# EAGLE design untitled (EAGLE 7.7.0)
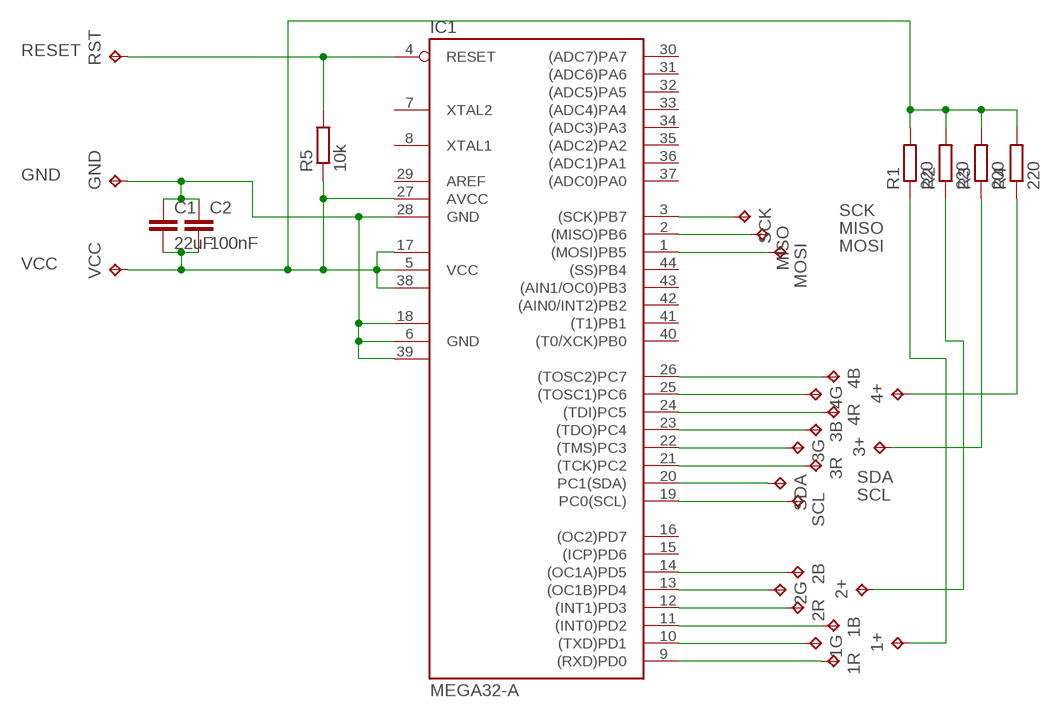
[diagram p0: schematic, sheet 1]

## Parts
1+  TPTP19SQ  [TP19SQ]
1B  TPTP19SQ  [TP19SQ]
1G  TPTP19SQ  [TP19SQ]
1R  TPTP19SQ  [TP19SQ]
2+  TPTP19SQ  [TP19SQ]
2B  TPTP19SQ  [TP19SQ]
2G  TPTP19SQ  [TP19SQ]
2R  TPTP19SQ  [TP19SQ]
3+  TPTP19SQ  [TP19SQ]
3B  TPTP19SQ  [TP19SQ]
3G  TPTP19SQ  [TP19SQ]
3R  TPTP19SQ  [TP19SQ]
4+  TPTP19SQ  [TP19SQ]
4B  TPTP19SQ  [TP19SQ]
4G  TPTP19SQ  [TP19SQ]
4R  TPTP19SQ  [TP19SQ]
C1  22uF  C-EU025-024X044  [C025-024X044]
C2  100nF  C-EU025-024X044  [C025-024X044]
GND  TPTP19SQ  [TP19SQ]
IC1  MEGA32-A  [TQFP44]
MISO  TPTP19SQ  [TP19SQ]
MOSI  TPTP19SQ  [TP19SQ]
R1  220  R-EU_M0805  [M0805]
R2  220  R-EU_M0805  [M0805]
R3  200  R-EU_M0805  [M0805]
R4  220  R-EU_M0805  [M0805]
R5  10k  R-EU_M0805  [M0805]
RST  TPTP19SQ  [TP19SQ]
SCK  SCK  TPTP19SQ  [TP19SQ]
SCL  TPTP19SQ  [TP19SQ]
SDA  TPTP19SQ  [TP19SQ]
VCC  TPTP19SQ  [TP19SQ]

## Nets
GND: C1.1 C2.1 GND.TP IC1.6(GND) IC1.18(GND1) IC1.28(GND) IC1.39(GND2)
MISO: IC1.2((MISO)PB6) MISO.TP
MOSI: IC1.1((MOSI)PB5) MOSI.TP
N$1: 1R.TP IC1.9((RXD)PD0)
N$2: 1G.TP IC1.10((TXD)PD1)
N$3: 1B.TP IC1.11((INT0)PD2)
N$4: 2R.TP IC1.12((INT1)PD3)
N$5: 2G.TP IC1.13((OC1B)PD4)
N$6: 2B.TP IC1.14((OC1A)PD5)
N$7: 3R.TP IC1.21((TCK)PC2)
N$8: 3G.TP IC1.22((TMS)PC3)
N$9: 3B.TP IC1.23((TDO)PC4)
N$10: 4R.TP IC1.24((TDI)PC5)
N$11: 4G.TP IC1.25((TOSC1)PC6)
N$12: 4B.TP IC1.26((TOSC2)PC7)
N$13: 1+.TP R1.1
N$14: 2+.TP R2.1
N$15: 3+.TP R3.1
N$16: 4+.TP R4.1
RESET: IC1.4(RESET) R5.2 RST.TP
SCK: IC1.3((SCK)PB7) SCK.TP
SCL: IC1.19(PC0(SCL)) SCL.TP
SDA: IC1.20(PC1(SDA)) SDA.TP
VCC: C1.2 C2.2 IC1.5(VCC) IC1.17(VCC1) IC1.27(AVCC) IC1.38(VCC2) R1.2 R2.2 R3.2 R4.2 R5.1 VCC.TP
Unconnected: IC1.7(XTAL2) IC1.8(XTAL1) IC1.15((ICP)PD6) IC1.16((OC2)PD7) IC1.29(AREF) IC1.30((ADC7)PA7) IC1.31((ADC6)PA6) IC1.32((ADC5)PA5) IC1.33((ADC4)PA4) IC1.34((ADC3)PA3) IC1.35((ADC2)PA2) IC1.36((ADC1)PA1) IC1.37((ADC0)PA0) IC1.40((T0/XCK)PB0) IC1.41((T1)PB1) IC1.42((AIN0/INT2)PB2) IC1.43((AIN1/OC0)PB3) IC1.44((SS)PB4)

## Library data of the parts
1+ 1B 1G 1R 2+ 2B 2G 2R 3+ 3B 3G 3R 4+ 4B 4G 4R GND MISO MOSI RST SCK SCL SDA VCC = testpad:TP: Test pad
C1 C2 = resistor:C-EU: CAPACITOR, European symbol
IC1 = atmel:MEGA32: MICROCONTROLLER 32 Kbytes FLASH 2 Kbytes SRAM 1 Kbytes EEPROM USART 8-channel 10 bit ADC Source: www.atmel.com .. doc2503.pdf; MPN: ATMEGA32-16AU; OC_FARNELL: 9171274; OC_NEWARK: 69K6677
R1-R5 = rcl:R-EU_: RESISTOR, European symbol

## Board
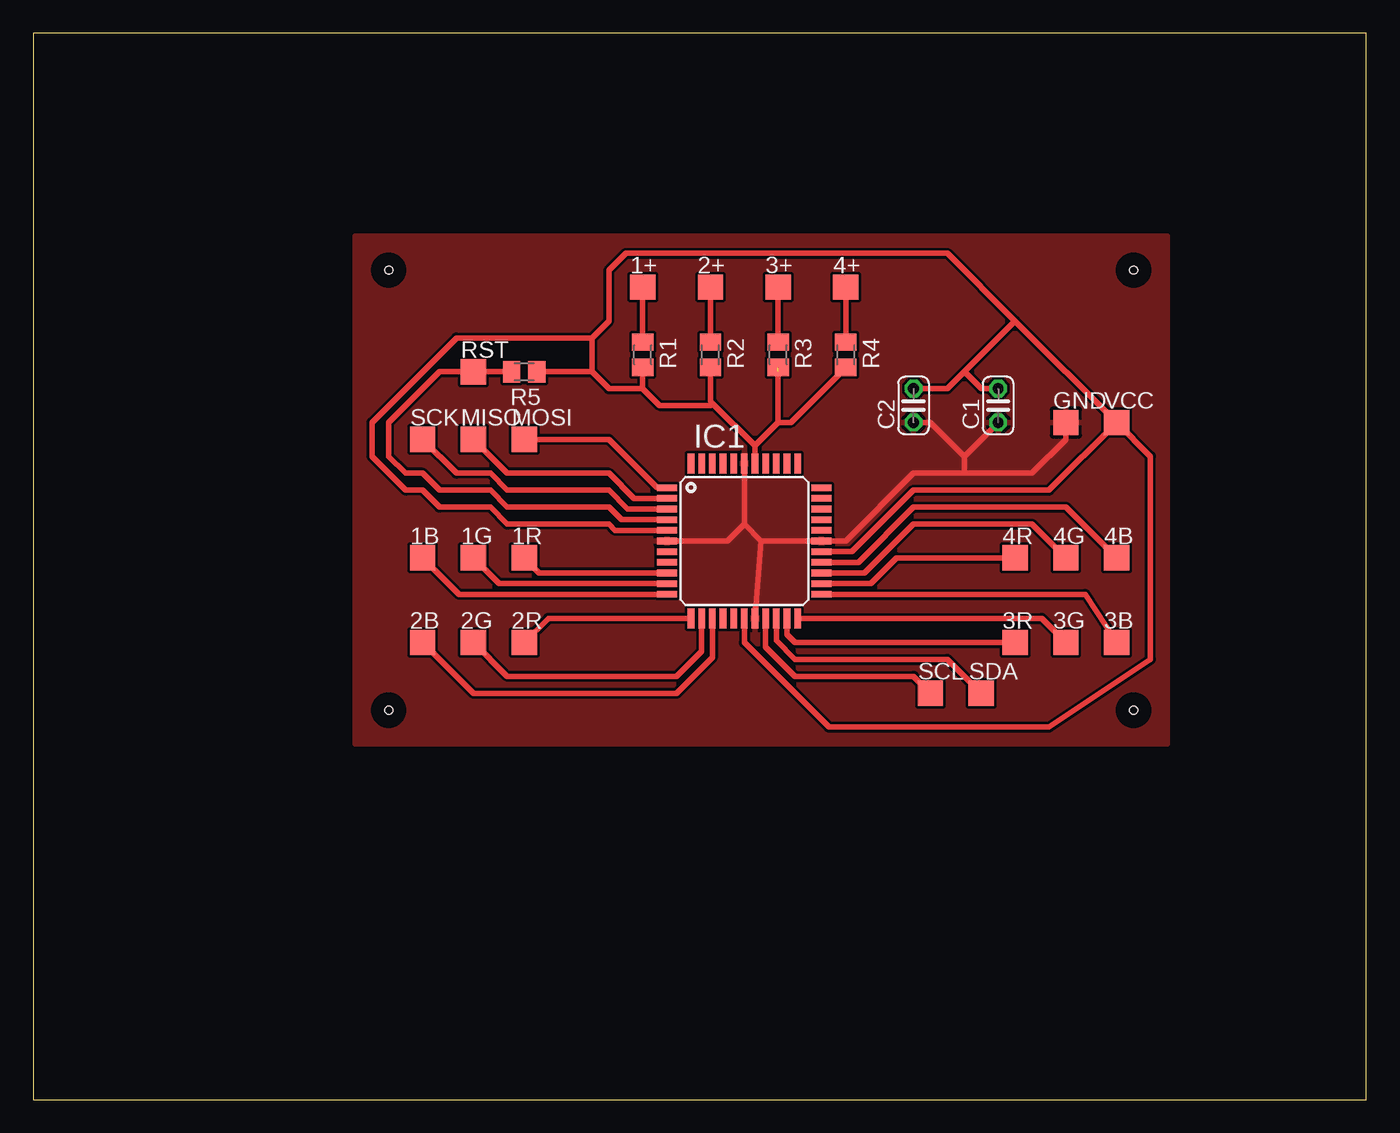
[diagram p1: board, top side]

Size 100 x 80 mm. Coordinates in mm from the lower left corner, seen from the top.
Outline: 0,0 100,0 100,80 0,80 0,0
Copper layers (1*16): Top 0.035mm / dielectric 1.5mm / Bottom 0.035mm
Design rules "default": minimum track width 10mil, minimum drill 24mil, track to track 8mil, track to pad 8mil, pad to pad 8mil, via to via 8mil, smd to smd 8mil, copper to edge 40mil, drill to drill 8mil, minimum pad ring 10mil, minimum via ring 8mil, stop-mask expansion 4mil, vias tented up to drill 0mil, thermal gap 10mil
Holes 0.6 mm at 26.67,62.23 26.67,29.21 82.55,62.23 82.55,29.21

### Footprints (pad centres in the part's own frame; a part is rotated, then mirrored left to right if it is on the bottom)
TP19SQ = smd 1.9 x 1.9: TP 0,0
C025-024X044 = drill 0.813 octagon: 1 -1.27,0; 2 1.27,0
TQFP44 = smd 1.5 x 0.5: 1 -5.8,4; 2 -5.8,3.2; 3 -5.8,2.4; 4 -5.8,1.6; 5 -5.8,0.8; 6 -5.8,0; 7 -5.8,-0.8; 8 -5.8,-1.6; 9 -5.8,-2.4; 10 -5.8,-3.2; 11 -5.8,-4; 23 5.8,-4; 24 5.8,-3.2; 25 5.8,-2.4; 26 5.8,-1.6; 27 5.8,-0.8; 28 5.8,0; 29 5.8,0.8; 30 5.8,1.6; 31 5.8,2.4; 32 5.8,3.2; 33 5.8,4 | smd 0.5 x 1.5: 12 -4,-5.8; 13 -3.2,-5.8; 14 -2.4,-5.8; 15 -1.6,-5.8; 16 -0.8,-5.8; 17 0,-5.8; 18 0.8,-5.8; 19 1.6,-5.8; 20 2.4,-5.8; 21 3.2,-5.8; 22 4,-5.8; 34 4,5.8; 35 3.2,5.8; 36 2.4,5.8; 37 1.6,5.8; 38 0.8,5.8; 39 0,5.8; 40 -0.8,5.8; 41 -1.6,5.8; 42 -2.4,5.8; 43 -3.2,5.8; 44 -4,5.8
M0805 = smd 1.3 x 1.6: 1 -0.95,0; 2 0.95,0

### Placement (x,y rotation side)
1+  45.72,60.96 0 top
1B  29.21,40.64 0 top
1G  33.02,40.64 0 top
1R  36.83,40.64 0 top
2+  50.8,60.96 0 top
2B  29.21,34.29 0 top
2G  33.02,34.29 0 top
2R  36.83,34.29 0 top
3+  55.88,60.96 0 top
3B  81.28,34.29 0 top
3G  77.47,34.29 0 top
3R  73.66,34.29 0 top
4+  60.96,60.96 0 top
4B  81.28,40.64 0 top
4G  77.47,40.64 0 top
4R  73.66,40.64 0 top
C1  72.39,52.07 90 top
C2  66.04,52.07 90 top
GND  77.47,50.8 0 top
IC1  53.34,41.91 0 top
MISO  33.02,49.53 0 top
MOSI  36.83,49.53 0 top
R1  45.72,55.88 270 top
R2  50.8,55.88 270 top
R3  55.88,55.88 270 top
R4  60.96,55.88 270 top
R5  36.83,54.61 180 top
RST  33.02,54.61 0 top
SCK  29.21,49.53 0 top
SCL  67.31,30.48 0 top
SDA  71.12,30.48 0 top
VCC  81.28,50.8 0 top

### Tracks (layer width: path | path; a pad name or v marks a point on that pad's centre or on a via)
GND
  Top 0.406: 69.85,46.99 66.04,46.99 60.96,41.91 IC1.28 54.61,41.91 | 69.85,46.99 74.93,46.99 77.47,49.53 GND.TP | IC1.6 52.07,41.91 53.34,43.18 | 54.61,41.91 53.34,43.18 | IC1.39 53.34,43.18 | IC1.18 54.61,41.91 | C2.1 67.31,50.8 69.85,48.26 | C1.1 69.85,48.26 | 69.85,48.26 69.85,46.99
  pour Top: 24.13,64.77 85.09,64.77 85.09,26.67 24.13,26.67
MISO
  Top 0.406: IC1.2 45.06,45.11 43.18,46.99 35.56,46.99 MISO.TP
MOSI
  Top 0.406: IC1.1 46.8,45.91 43.18,49.53 MOSI.TP
N$1
  Top 0.406: IC1.9 37.96,39.51 1R.TP
N$2
  Top 0.406: IC1.10 34.95,38.71 1G.TP
N$3
  Top 0.406: IC1.11 31.94,37.91 1B.TP
N$4
  Top 0.406: IC1.12 38.65,36.11 2R.TP
N$5
  Top 0.406: IC1.13 50.14,33.63 48.26,31.75 35.56,31.75 2G.TP
N$6
  Top 0.406: IC1.14 50.94,33.16 48.26,30.48 33.02,30.48 2B.TP
N$7
  Top 0.406: IC1.21 56.54,34.9 57.15,34.29 3R.TP
N$8
  Top 0.406: IC1.22 75.65,36.11 3G.TP
N$9
  Top 0.406: IC1.23 78.93,37.91 3B.TP
N$10
  Top 0.406: IC1.24 62.84,38.71 64.77,40.64 4R.TP
N$11
  Top 0.406: IC1.25 62.37,39.51 66.04,43.18 74.93,43.18 4G.TP
N$12
  Top 0.406: IC1.26 61.9,40.31 66.04,44.45 77.47,44.45 4B.TP
N$13
  Top 0.406: R1.1 1+.TP
N$14
  Top 0.406: R2.1 2+.TP
N$15
  Top 0.406: R3.1 3+.TP
N$16
  Top 0.406: R4.1 4+.TP
RESET
  Top 0.406: R5.2 RST.TP 30.48,54.61 26.67,50.8 26.67,48.26 27.94,46.99 29.21,46.99 30.48,45.72 34.29,45.72 35.56,44.45 43.18,44.45 44.12,43.51 IC1.4
SCK
  Top 0.406: IC1.3 44.59,44.31 43.18,45.72 35.56,45.72 34.29,46.99 31.75,46.99 SCK.TP
SCL
  Top 0.406: IC1.19 54.94,33.96 57.15,31.75 66.04,31.75 SCL.TP
SDA
  Top 0.406: IC1.20 55.74,34.43 57.15,33.02 68.58,33.02 SDA.TP
VCC  (1 unrouted)
  Top 0.406: IC1.27 61.43,41.11 66.04,45.72 76.2,45.72 VCC.TP | IC1.17 53.34,34.29 59.69,27.94 76.2,27.94 83.82,33.02 83.82,48.26 VCC.TP | IC1.5 43.65,42.71 43.18,43.18 35.56,43.18 34.29,44.45 30.48,44.45 29.21,45.72 27.94,45.72 25.4,48.26 25.4,50.8 31.75,57.15 41.91,57.15 | 41.91,57.15 43.18,58.42 43.18,62.23 44.45,63.5 68.58,63.5 73.66,58.42 | 73.66,58.42 VCC.TP | IC1.38 54.14,49.06 | 54.14,49.06 55.88,50.8 | 55.88,50.8 56.83,50.8 R4.2 | 55.88,50.8 55.88,54.61 | R2.2 50.8,52.4 50.97,52.23 | 50.97,52.23 54.14,49.06 | R1.2 45.72,53.34 | 45.72,53.34 46.99,52.07 50.8,52.07 50.97,52.23 | R5.1 41.91,54.61 | 41.91,54.61 43.18,53.34 45.72,53.34 | 41.91,54.61 41.91,57.15 | C1.2 71.12,53.34 69.85,54.61 | C2.2 68.58,53.34 69.85,54.61 | 69.85,54.61 73.66,58.42